# EAGLE design Blinky Board (EAGLE 7.0.0)
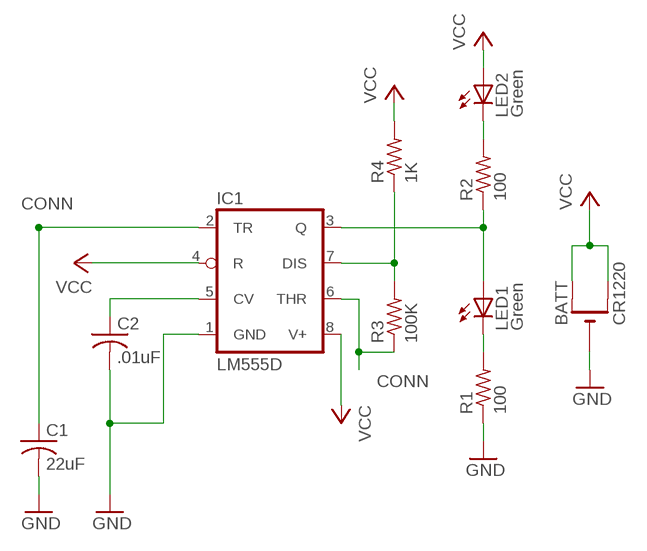
[diagram p0: schematic, sheet 1]

## Parts
BATT  CR1220  CR1220SMT  [CR1220-SMD]
C1  22uF  C-USC0805  [C0805]
C2  .01uF  C-USC0805  [C0805]
IC1  LM555D  [SO08]
LED1  Green  LEDCHIPLED_0805  [CHIPLED_0805]
LED2  Green  LEDCHIPLED_0805  [CHIPLED_0805]
R1  100  R-US_R0805  [R0805]
R2  100  R-US_R0805  [R0805]
R3  100K  R-US_R0805  [R0805]
R4  1K  R-US_R0805  [R0805]

## Nets
CONN: C1.1 IC1.2(TR) IC1.6(THR) R3.1
GND: BATT.- C1.2 C2.2 IC1.1(GND) R1.1
N$1: LED2.C R2.2
N$2: IC1.3(Q) LED1.A R2.1
N$3: LED1.C R1.2
N$6: IC1.7(DIS) R3.2 R4.1
N$8: C2.1 IC1.5(CV)
VCC: BATT.+$1(+) BATT.+$2(+1) IC1.4(R) IC1.8(V+) LED2.A R4.2

## Library data of the parts
BATT = adafruit:CR1220: CR1216/CR1220/CR1225 12mm 3V lithium coin cell Great for battery packup. Both SMT and THM holders. Note the THM package has the ground pads on both sides of the PCB so that the masks are the same - this reduces the cost; OC_NEWARK: unknown
C1 = adafruit:C-US: CAPACITOR, American symbol; MPN: C2012X5R1A226K125AB; OC_NEWARK: 04X3270
C2 = adafruit:C-US: CAPACITOR, American symbol; MPN: GRM216R71H103KA01D; OC_NEWARK: 14T3354
IC1 = adafruit:*555: TIMER Changed DIP package to have round (not oval) pin pads http://www.ladyada.net/library/pcb/eaglelibrary.html; MPN: TLC555CD.; OC_NEWARK: 50R6850
LED1 LED2 = adafruit:LED: LED OSRAM: - CHIPLED LG R971, LG N971, LY N971, LG Q971, LY Q971, LO R971, LY R971 LH N974, LH R974 LS Q976, LO Q976, LY Q976 LO Q996 - Hyper CHIPLED LW Q18S LB Q993, LB Q99A, LB R99A - SideLED LS A670, LO A670, LY A670, LG A670, LP A670 LB A673, LV A673, LT A673, LW A673 LH A674 LY A675 LS A676, LA A676, LO A676, LY A676, LW A676 LS A679, LY A679, LG A679 - Hyper Micro SIDELED® LS Y876, LA Y876, LO Y876, LY Y876 LT Y87S - SmartLED LW L88C, LW L88S LB L89C, LB L89S, LG L890 LS L89K, LO L89K, LY L89K LS L896, LA L896, LO L896, LY L896 - TOPLED LS T670, LO T670, LY T670, LG T670, LP T670 LSG T670, LSP T670, LSY T670, LOP T670, LYG T670 LG T671, LOG T671, LSG T671 LB T673, LV T673, LT T673, LW T673 LH T674 LS T676, LA T676, LO T676, LY T676, LB T676, LH T676, LSB T676, LW T676 LB T67C, LV T67C, LT T67C, LS T67K, LO T67K, LY T67K, LW E67C LS E67B, LA E67B, LO E67B, LY E67B, LB E67C, LV E67C, LT E67C LW T67C LS T679, LY T679, LG T679 LS T770, LO T770, LY T770, LG T770, LP T770 LB T773, LV T773, LT T773, LW T773 LH T774 LS E675, LA E675, LY E675, LS T675 LS T776, LA T776, LO T776, LY T776, LB T776 LHGB T686 LT T68C, LB T68C - Hyper Mini TOPLED® LB M676 - Mini TOPLED Santana® LG M470 LS M47K, LO M47K, LY M47K Source: http://www.osram.convergy.de/; MPN: 150080GS75000; OC_NEWARK: 95W3800
R1 R2 = adafruit:R-US_: RESISTOR, American symbol; MPN: CR0805-FX-1000-ELF; OC_NEWARK: 10P9700
R3 = adafruit:R-US_: RESISTOR, American symbol; MPN: MCHV05WAJ0104T5E; OC_NEWARK: 01N7279
R4 = adafruit:R-US_: RESISTOR, American symbol; MF: VISHAY/DALE; MPN: CRCW08051K00FKTA; OC_NEWARK: 05F1507

## Net classes
0 default: width 0.305 mm, drill 0.508 mm, clearance 0.254 mm

## Board
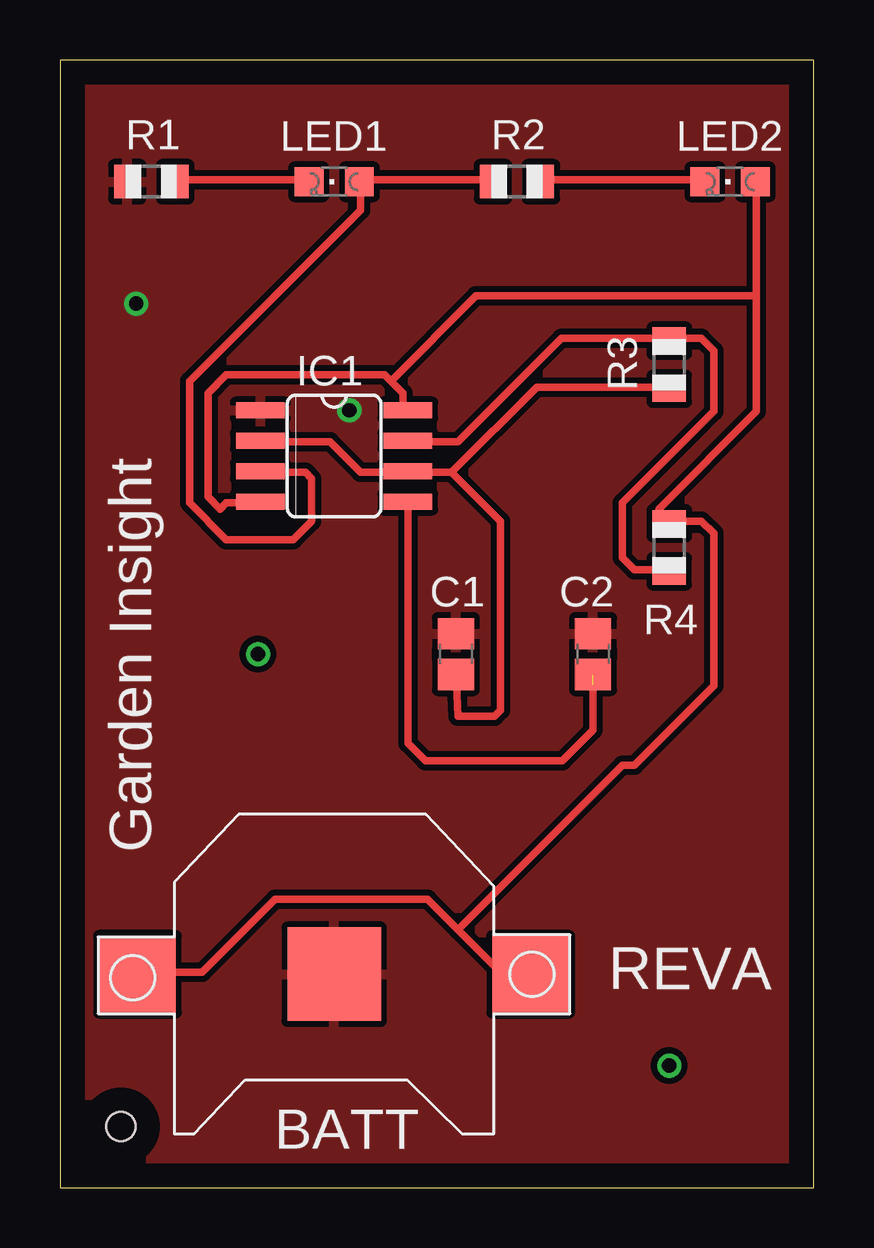
[diagram p1: board, top side]
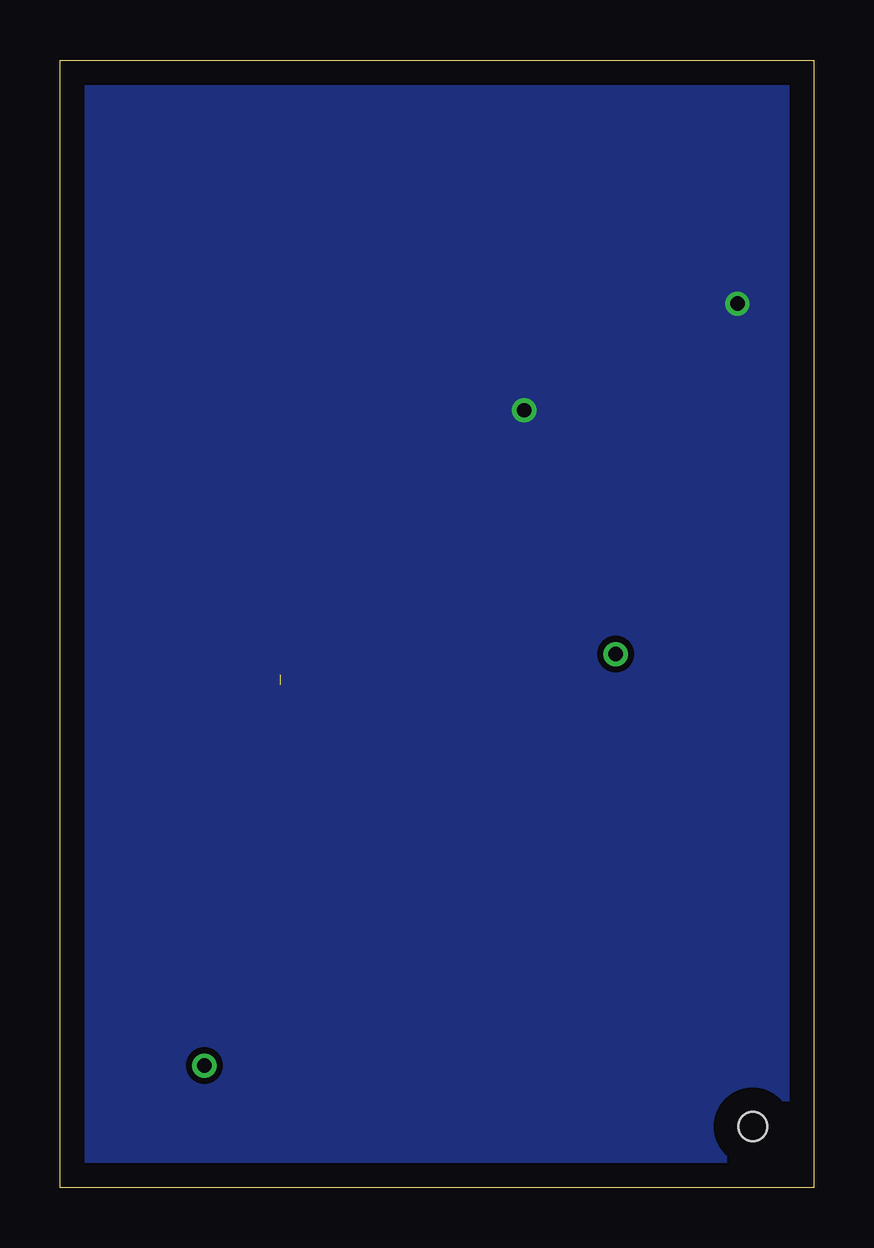
[diagram p2: board, bottom side, seen from below]

Size 31.42 x 46.98 mm. Coordinates in mm from the lower left corner, seen from the top.
Outline: 0,0 31.42,0 31.42,46.98 0,46.98 0,0
Copper layers (1*16): Top 0.035mm / dielectric 1.5mm / Bottom 0.035mm
Design rules "default": minimum track width 10mil, minimum drill 24mil, track to track 8mil, track to pad 8mil, pad to pad 8mil, via to via 8mil, smd to smd 8mil, copper to edge 40mil, drill to drill 8mil, minimum pad ring 10mil, minimum via ring 8mil, stop-mask expansion 4mil, vias tented up to drill 0mil, thermal gap 10mil
Holes 1.2 mm at 2.54,2.54

### Footprints (pad centres in the part's own frame; a part is rotated, then mirrored left to right if it is on the bottom)
CR1220-SMD = smd 3.2 x 3.2: +$1 -8.2,0; +$2 8.2,0 | smd 3.9 x 3.9: - 0,0
C0805 = smd 1.3 x 1.5: 1 -0.85,0; 2 0.85,0
SO08 = smd 0.66 x 2.032: 1 -1.905,-3.073; 2 -0.635,-3.073; 3 0.635,-3.073; 4 1.905,-3.073; 5 1.905,3.073; 6 0.635,3.073; 7 -0.635,3.073; 8 -1.905,3.073
CHIPLED_0805 = smd 1.2 x 1.2: A 0,-1.05; C 0,1.05
R0805 = smd 1.1 x 1.4: 1 -1,0; 2 1,0

### Placement (x,y rotation side)
BATT  11.43,8.89 180 top
C1  16.51,22.23 90 top
C2  22.23,22.23 90 top
IC1  11.43,30.48 270 top
LED1  11.43,41.91 90 top
LED2  27.94,41.91 90 top
R1  3.81,41.91 0 top
R2  19.05,41.91 0 top
R3  25.4,34.29 90 top
R4  25.4,26.67 90 top

### Tracks (layer width: path | path; a pad name or v marks a point on that pad's centre or on a via)
CONN
  Top 0.305: 16.33,29.79 19.89,33.35 25.22,33.35 R3.1 | 16.33,29.79 14.55,29.79 IC1.6 14.3,29.79 12.52,29.79 11.25,31.06 8.46,31.06 IC1.2 | 16.33,29.79 18.36,27.76 18.36,19.89 18.11,19.63 16.59,19.63 C1.1
GND  (via drill 0.6)
  other vias: 3.17,36.83 12.06,32.38
  pour Top: -1.27,48.26 -1.27,-1.27 33.02,-1.27 33.02,48.26
  pour Bottom: -0.64,47.62 32.38,47.62 32.38,-0.64 -0.64,-0.64 -1.27,-0.64 -1.27,47.62
N$1
  Top 0.305: LED2.C 26.75,41.99 20.14,41.99 R2.2
N$2
  Top 0.305: R2.1 17.86,41.99 12.52,41.99 LED1.A 12.52,41.73 12.52,40.72 5.41,33.6 5.41,28.52 6.93,27 9.73,27 10.49,27.76 10.49,29.54 10.24,29.79 8.46,29.79 IC1.3
N$3
  Top 0.305: LED1.C 10.24,41.99 4.9,41.99 R1.2
N$4  (via drill 0.6)
  other vias: 8.26,22.23
N$5  (via drill 0.6)
  other vias: 25.4,5.08
N$6
  Top 0.305: R4.1 25.22,25.73 23.95,25.73 23.44,26.24 23.44,28.52 27.25,32.33 27.25,34.87 26.75,35.38 25.48,35.38 R3.2 25.22,35.38 20.9,35.38 16.59,31.06 14.55,31.06 IC1.7
N$8  (1 unrouted)
  Top 0.305: IC1.5 14.5,18.52 15.24,17.78 20.95,17.78 22.23,19.05 22.23,20.95
VCC
  Top 0.305: 16.59,10.74 18.36,8.97 19.38,8.97 BATT.+$1 | 16.59,10.74 15.32,12.01 8.97,12.01 5.92,8.97 3.38,8.97 BATT.+$2 | 13.79,33.6 14.3,33.1 14.3,32.59 IC1.8 | 13.79,33.6 13.54,33.86 6.93,33.86 6.17,33.1 6.17,28.78 6.68,28.27 6.93,28.52 8.2,28.52 IC1.4 | 29.03,37.16 29.03,32.33 24.97,28.27 24.97,28.02 25.22,27.76 R4.2 25.48,27.76 26.75,27.76 27.25,27.25 27.25,20.9 23.95,17.6 23.44,17.6 16.59,10.74 | 29.03,37.16 29.03,41.73 LED2.A | 13.79,33.6 17.35,37.16 29.03,37.16

### Text on the board
tPlace: Garden Insight | REVA